# Altium schematic sheet AuxHalfH.SchDoc: ODRIVE-FOC
size A3; DocumentNumber: SEASKY; Revision: V1.1
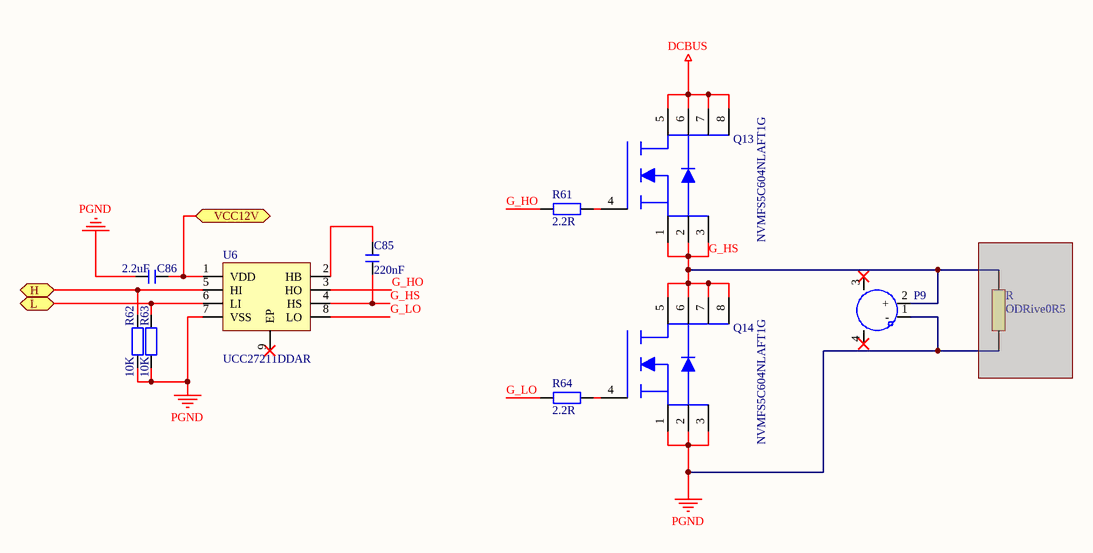
[diagram p0: AuxHalfH.SchDoc]

## Parts
C85  220nF  [C 0805_L]
C86  2.2uF  [C 0603_L]
P9  XT60PW  [XT60PW]  (value not drawn)
Q13  NVMFS5C604NLAFT1G  [PG-TDSON-8_L5.0-W6.0-P1.27-LS6.2-BL-EP]
Q14  NVMFS5C604NLAFT1G  [PG-TDSON-8_L5.0-W6.0-P1.27-LS6.2-BL-EP]
R  ODRive0R5  [ODrive_0R5]  (masked out: inside a compile mask, not in the netlist)
R61  2.2R  [R 0603_L]
R62  10K  [R 0603_L]
R63  10K  [R 0603_L]
R64  2.2R  [R 0603_L]
U6  UCC27211DDAR  [SO-8_EP]

## Ports
H (bidir), L (bidir), VCC12V (bidir)

## Nets
DCBUS: Q13.5 Q13.6 Q13.7 Q13.8
PGND: C86.2 P9.1(-) Q14.1 Q14.2 Q14.3 R62.1 R63.1 U6.7(VSS)
G_HO: R61.1 U6.3(HO)
G_HS: C85.1 P9.2(+) Q13.1 Q13.2 Q13.3 Q14.5 Q14.6 Q14.7 Q14.8 U6.4(HS)
G_LO: R64.1 U6.8(LO)
H: R62.2 U6.5(HI) ; port H
L: R63.2 U6.6(LI) ; port L
VCC12V: C86.1 U6.1(VDD) ; port VCC12V
NetC85_2: C85.2 U6.2(HB)
NetQ13_4: Q13.4 R61.2
NetQ14_4: Q14.4 R64.2

Not connected (* = marked no-connect by the designer): P9 3* 4*; U6 9(EP)*

## Notes on the sheet
- Title
- Size:
- Date:
- A3
- Number:
- Time:
- Revision:
- Sheet
- of
- File:

## Library data of the parts
C85 C86 = C: 贴片电容
Q13 Q14 = BSC037N08NS5ATMA1
R61-R64 = R: 贴片电阻